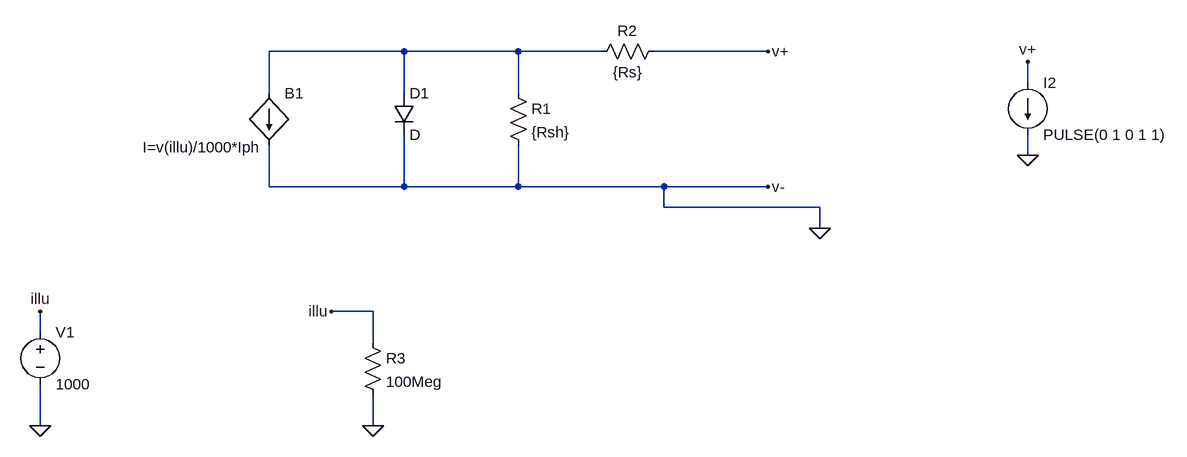
[diagram p0: schematic sch1.asc]
sch1.asc, the LTspice schematic file:
Version 4
SHEET 1 1472 680
WIRE 288 48 80 48
WIRE 464 48 288 48
WIRE 592 48 464 48
WIRE 848 48 672 48
WIRE 1248 96 1248 64
WIRE 80 112 80 48
WIRE 288 112 288 48
WIRE 464 112 464 48
WIRE 1248 208 1248 176
WIRE 80 256 80 192
WIRE 288 256 288 176
WIRE 288 256 80 256
WIRE 464 256 464 192
WIRE 464 256 288 256
WIRE 688 256 464 256
WIRE 848 256 688 256
WIRE 688 288 688 256
WIRE 928 288 688 288
WIRE 928 320 928 288
WIRE 240 448 176 448
WIRE -272 480 -272 448
WIRE 240 496 240 448
WIRE -272 624 -272 560
WIRE 240 624 240 576
FLAG 928 320 0
FLAG 240 624 0
FLAG 176 448 illu
FLAG 848 48 v+
FLAG 848 256 v-
FLAG -272 624 0
FLAG -272 448 illu
FLAG 1248 208 0
FLAG 1248 64 v+
SYMBOL diode 272 112 R0
SYMATTR InstName D1
SYMBOL res 448 96 R0
SYMATTR InstName R1
SYMATTR Value {Rsh}
SYMBOL res 688 32 R90
WINDOW 0 0 56 VBottom 2
WINDOW 3 32 56 VTop 2
SYMATTR InstName R2
SYMATTR Value {Rs}
SYMBOL res 224 480 R0
SYMATTR InstName R3
SYMATTR Value 100Meg
SYMBOL voltage -272 464 R0
WINDOW 123 0 0 Left 0
WINDOW 39 0 0 Left 0
SYMATTR InstName V1
SYMATTR Value 1000
SYMBOL current 1248 96 R0
WINDOW 123 0 0 Left 0
WINDOW 39 0 0 Left 0
SYMATTR InstName I2
SYMATTR Value PULSE(0 1 0 1 1)
SYMBOL bi 80 112 R0
WINDOW 3 -12 83 Right 2
SYMATTR InstName B1
SYMATTR Value I=v(illu)/1000*Iph

The netlist it stands for:
* sch1.asc
D1 N001 0 D
R1 N001 0 {Rsh}
R2 v+ N001 {Rs}
R3 illu 0 100Meg
V1 illu 0 1000
I2 v+ 0 PULSE(0 1 0 1 1)
B1 N001 0 I=v(illu)/1000*Iph
.model D D
.lib standard.dio
.backanno
.end